# EAGLE schematic charger (EAGLE 4.16)
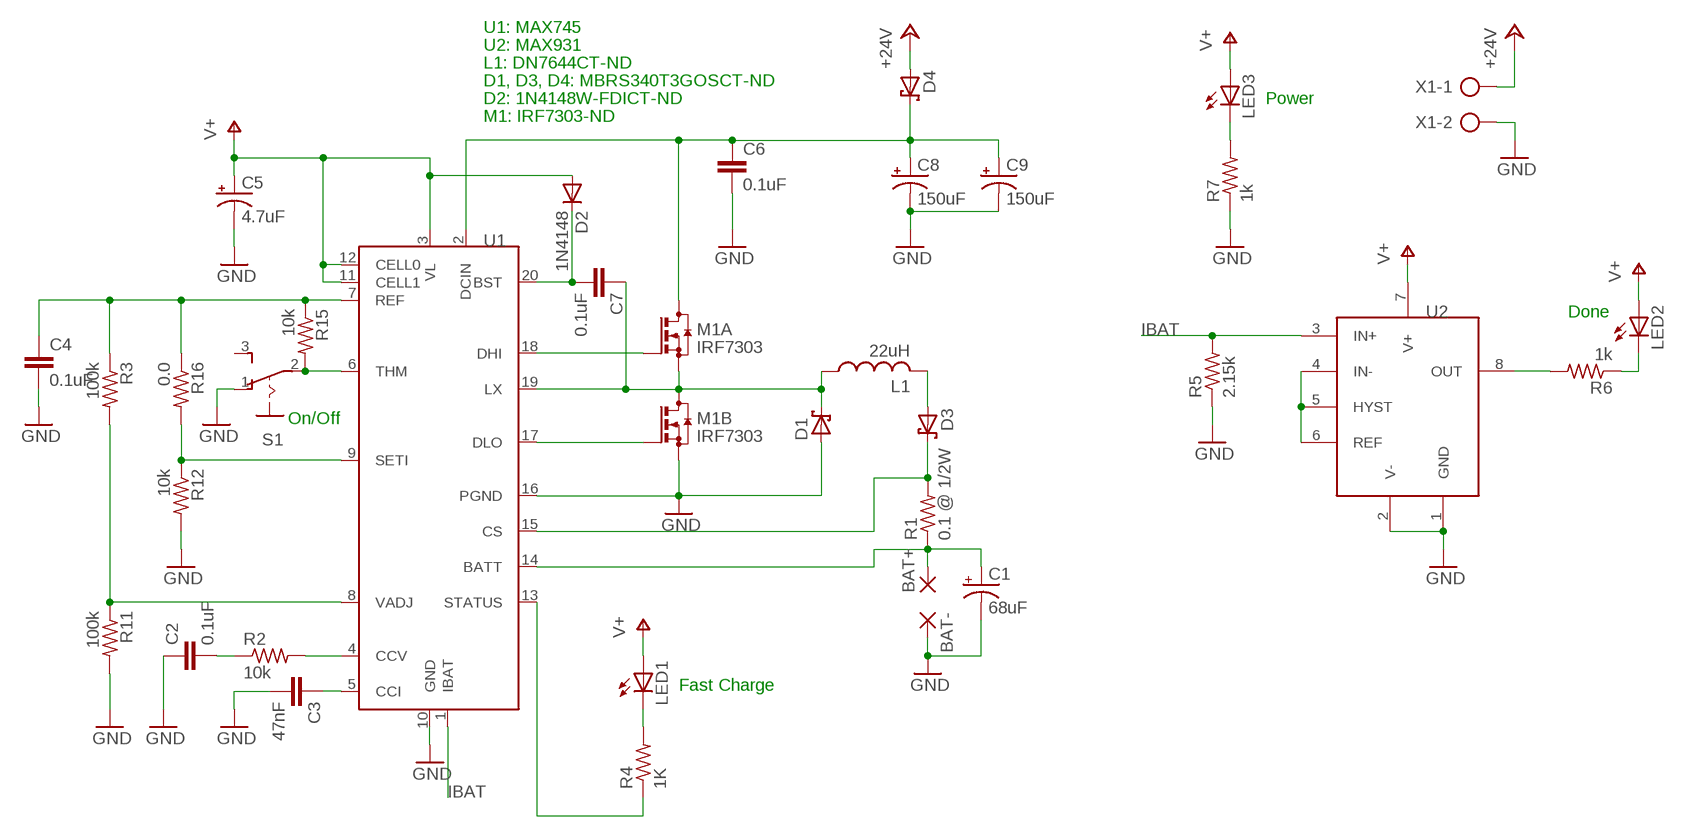
[diagram p0: schematic, sheet 1]

## Parts
BAT+  2,54/1,1  [2,54/1,1]
BAT-  2,54/1,1  [2,54/1,1]
C1  68uF  CPOL-US153CLV-1010  [153CLV-1010]
C2  0.1uF  C-EUC0805  [C0805]
C3  47nF  C-EUC0805  [C0805]
C4  0.1uF  C-EUC0805  [C0805]
C5  4.7uF  CPOL-USSMCC  [SMC_C]
C6  0.1uF  C-EUC0805  [C0805]
C7  0.1uF  C-EUC0805  [C0805]
C8  150uF  CPOL-US150CLZ-1010  [150CLZ-1010]
C9  150uF  CPOL-US150CLZ-1010  [150CLZ-1010]
D1  SCHOTTKY-DIODESMC  [SMC]
D2  1N4148  [DO35-10]
D3  SCHOTTKY-DIODESMC  [SMC]
D4  SCHOTTKY-DIODESMC  [SMC]
L1  22uH  L-USL1812  [L1812]
LED1  LEDCHIPLED_0805  [CHIPLED_0805]
LED2  LEDCHIPLED_0805  [CHIPLED_0805]
LED3  LEDCHIPLED_0805  [CHIPLED_0805]
M1  IRF7303  [SO08]
R1  0.1 @ 1/2W  R-US_R0603  [R0603]
R2  10k  R-US_R0603  [R0603]
R3  100k  R-US_R0603  [R0603]
R4  1K  R-US_R0603  [R0603]
R5  2.15k  R-US_R0603  [R0603]
R6  1k  R-US_R0603  [R0603]
R7  1k  R-US_R0603  [R0603]
R11  100k  R-US_R0603  [R0603]
R12  10k  R-US_R0603  [R0603]
R15  10k  R-US_R0603  [R0603]
R16  0.0  R-US_R0603  [R0603]
S1  255SB  [255SB]
U1  MAX745  [SSOP20]
U2  MAX931  [SO08]
X1  AK500/2  [AK500/2]

## Nets
+24V: D4.A X1.1
GND: BAT-.1(P) C1.- C2.1 C3.2 C4.2 C5.- C6.2 C8.- C9.- D1.A M1.3(B:S) R5.1 R7.1 R11.2 R12.2 S1.1(O) U1.10(GND) U1.16(PGND) U2.1(GND) U2.2(V-) X1.2
IBAT: R5.2 U1.1(IBAT) U2.3(IN+)
N$1: R4.1 U1.13(STATUS)
N$2: R15.2 S1.2(P) U1.6(THM)
N$3: R3.2 R11.1 U1.8(VADJ)
N$4: C2.2 R2.1
N$5: R2.2 U1.4(CCV)
N$6: C3.1 U1.5(CCI)
N$7: R12.1 R16.2 U1.9(SETI)
N$8: C4.1 R3.1 R15.1 R16.1 U1.7(REF)
N$9: C7.2 D2.C U1.20(BST)
N$10: C6.1 C8.+ C9.+ D4.C M1.7(A:D) U1.2(DCIN)
N$11: LED1.C R4.2
N$12: C7.1 D1.C L1.1 M1.1(A:S) M1.6(B:D) U1.19(LX)
N$13: M1.4(B:G) U1.17(DLO)
N$14: M1.2(A:G) U1.18(DHI)
N$15: BAT+.1(P) C1.+ R1.1 U1.14(BATT)
N$16: D3.C R1.2 U1.15(CS)
N$17: D3.A L1.2
N$18: LED2.C R6.1
N$19: R6.2 U2.8(OUT)
N$20: LED3.C R7.2
N$21: U2.4(IN-) U2.5(HYST) U2.6(REF)
V+: C5.+ D2.A LED1.A LED2.A LED3.A U1.3(VL) U1.11(CELL1) U1.12(CELL0) U2.7(V+)
Unconnected: S1.3(S)

## Notes on the sheet
- U1: MAX745
- U2: MAX931
- L1: DN7644CT-ND
- D1, D3, D4: MBRS340T3GOSCT-ND
- D2: 1N4148W-FDICT-ND | Power
- M1: IRF7303-ND
- Done
- On/Off
- Fast Charge

## Library data of the parts
BAT+ BAT- = wirepad:2,54/1,1: THROUGH-HOLE PAD
C1 C5 C8 C9 = rcl:CPOL-US: POLARIZED CAPACITOR, American symbol
C2-C4 C6 C7 = rcl:C-EU: CAPACITOR, European symbol
D1 D3 D4 = diode:SCHOTTKY-DIODE: Schottky Diode
D2 = diode:1N4148: DIODE high speed (Philips)
L1 = rcl:L-US: INDUCTOR, American symbol
LED1-LED3 = led:LED: LED OSRAM: - CHIPLED LG R971, LG N971, LY N971, LG Q971, LY Q971, LO R971, LY R971 LH N974, LH R974 LS Q976, LO Q976, LY Q976 LO Q996 - Hyper CHIPLED LW Q18S LB Q993, LB Q99A, LB R99A - SideLED LS A670, LO A670, LY A670, LG A670, LP A670 LB A673, LV A673, LT A673, LW A673 LH A674 LY A675 LS A676, LA A676, LO A676, LY A676, LW A676 LS A679, LY A679, LG A679 - Hyper Micro SIDELED® LS Y876, LA Y876, LO Y876, LY Y876 LT Y87S - SmartLED LW L88C, LW L88S LB L89C, LB L89S, LG L890 LS L89K, LO L89K, LY L89K LS L896, LA L896, LO L896, LY L896 - TOPLED LS T670, LO T670, LY T670, LG T670, LP T670 LSG T670, LSP T670, LSY T670, LOP T670, LYG T670 LG T671, LOG T671, LSG T671 LB T673, LV T673, LT T673, LW T673 LH T674 LS T676, LA T676, LO T676, LY T676, LB T676, LH T676, LSB T676, LW T676 LB T67C, LV T67C, LT T67C, LS T67K, LO T67K, LY T67K, LW E67C LS E67B, LA E67B, LO E67B, LY E67B, LB E67C, LV E67C, LT E67C LW T67C LS T679, LY T679, LG T679 LS T770, LO T770, LY T770, LG T770, LP T770 LB T773, LV T773, LT T773, LW T773 LH T774 LS E675, LA E675, LY E675, LS T675 LS T776, LA T776, LO T776, LY T776, LB T776 LHGB T686 LT T68C, LB T68C - Hyper Mini TOPLED® LB M676 - Mini TOPLED Santana® LG M470 LS M47K, LO M47K, LY M47K Source: http://www.osram.convergy.de - LUMILED® LXK2-PW12-R00, LXK2-PW12-S00, LXK2-PW14-U00, LXK2-PW14-V00 LXK2-PM12-R00, LXK2-PM12-S00, LXK2-PM14-U00 LXK2-PE12-Q00, LXK2-PE12-R00, LXK2-PE12-S00, LXK2-PE14-T00, LXK2-PE14-U00 LXK2-PB12-K00, LXK2-PB12-L00, LXK2-PB12-M00, LXK2-PB14-N00, LXK2-PB14-P00, LXK2-PB14-Q00 LXK2-PR12-L00, LXK2-PR12-M00, LXK2-PR14-Q00, LXK2-PR14-R00 LXK2-PD12-Q00, LXK2-PD12-R00, LXK2-PD12-S00 LXK2-PH12-R00, LXK2-PH12-S00 LXK2-PL12-P00, LXK2-PL12-Q00, LXK2-PL12-R00 Source: www.luxeon.com
M1 = transistor-small-signal:IRF7303
R1-R7 R11 R12 R15 R16 = rcl:R-US_: RESISTOR, American symbol
S1 = switch:255SB: SLIDING SWITCH distributor Buerklin, 11G810
U1 = maxim:MAX745
U2 = maxim:MAX931
X1 = con-ptr500:AK500/2: CONNECTOR